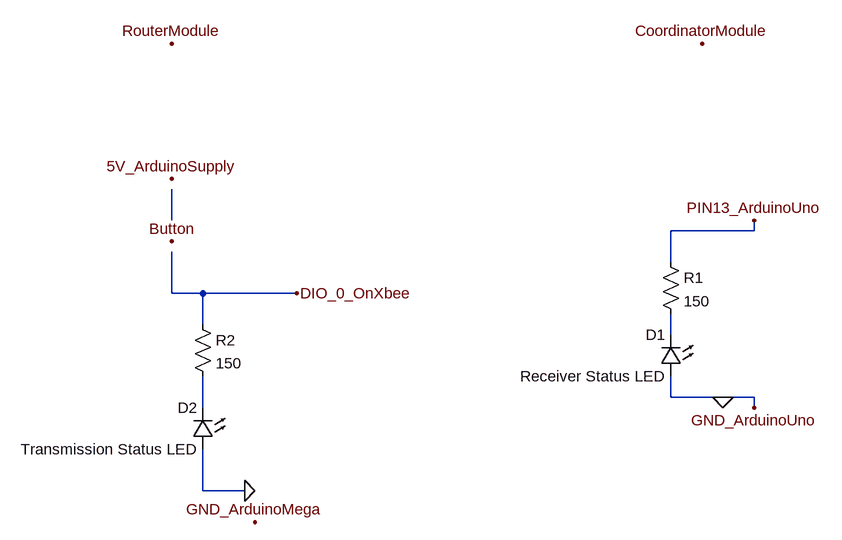
[diagram p0: schematic AXcoms.asc]
AXcoms.asc, the LTspice schematic file:
Version 4
SHEET 1 880 680
WIRE -640 48 -640 0
WIRE 256 64 256 48
WIRE 256 64 128 64
WIRE 128 112 128 64
WIRE -640 160 -640 96
WIRE -592 160 -640 160
WIRE -448 160 -592 160
WIRE -592 208 -592 160
WIRE 128 224 128 192
WIRE 128 320 128 288
WIRE 208 320 128 320
WIRE 256 320 208 320
WIRE -592 336 -592 288
WIRE 256 336 256 320
WIRE -592 464 -592 400
WIRE -528 464 -592 464
FLAG 256 48 PIN13_ArduinoUno
FLAG 256 336 GND_ArduinoUno
FLAG 176 -224 CoordinatorModule
FLAG 208 320 0
FLAG -528 464 0
FLAG -512 512 GND_ArduinoMega
FLAG -640 80 Button
FLAG -640 -16 5V_ArduinoSupply
FLAG -448 160 DIO_0_OnXbee
FLAG -640 -224 RouterModule
SYMBOL res 112 96 R0
SYMATTR InstName R1
SYMATTR Value 150
SYMBOL LED 144 288 R180
WINDOW 0 24 64 Left 2
WINDOW 3 24 0 Left 2
SYMATTR InstName D1
SYMATTR Value Receiver Status LED
SYMBOL res -608 192 R0
SYMATTR InstName R2
SYMATTR Value 150
SYMBOL LED -576 400 R180
WINDOW 0 24 64 Left 2
WINDOW 3 24 0 Left 2
SYMATTR InstName D2
SYMATTR Value Transmission Status LED

The netlist it stands for:
* AXcoms.asc
R1 PIN13_ArduinoUno N002 150
D1 0 N002 Receiver Status LED
R2 DIO_0_OnXbee N003 150
D2 0 N003 Transmission Status LED
.model D D
.lib standard.dio
.backanno
.end